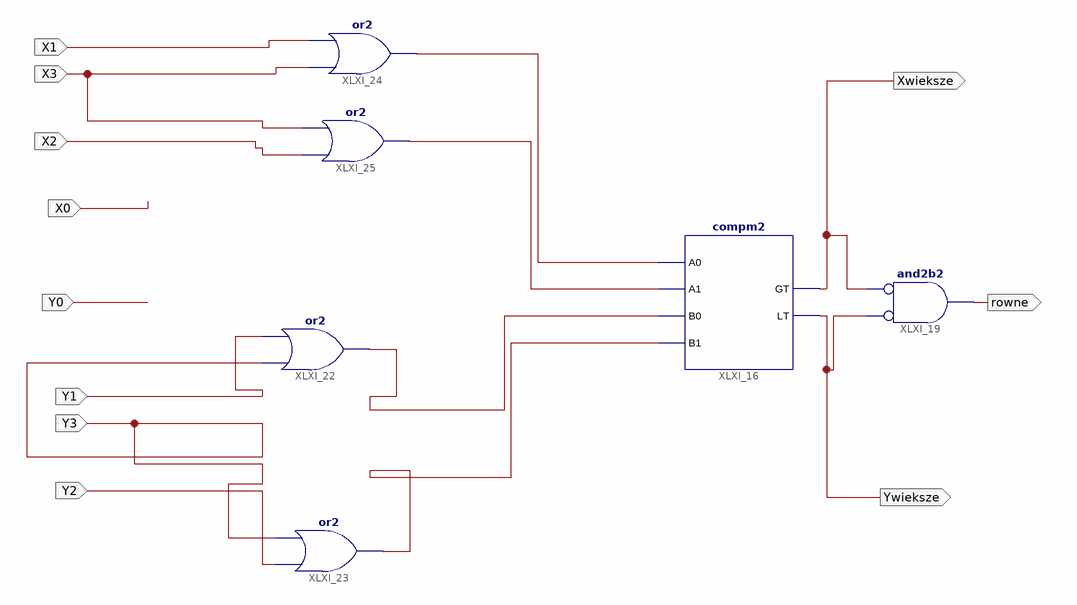
[diagram p0: schematic sheet 1]
// Xilinx ISE schematic dwaZ4_schemat.sch (artix7) as structural Verilog: 6 symbols, 11 ports
module dwaZ4_schemat (
  input  X1,
  input  X3,
  input  X2,
  input  Y1,
  input  Y3,
  input  Y2,
  input  Y0,
  input  X0,
  output Xwieksze,
  output Ywieksze,
  output rowne
);

  wire XLXN_46, XLXN_56, XLXN_57, XLXN_62;

  compm2 XLXI_16 (.A0(XLXN_56), .A1(XLXN_57), .B0(XLXN_62), .B1(XLXN_46), .GT(Xwieksze), .LT(Ywieksze));
  and XLXI_19 (rowne, ~Ywieksze, ~Xwieksze);  // and2b2
  or XLXI_22 (XLXN_62, Y3, Y1);
  or XLXI_23 (XLXN_46, Y2, Y3);
  or XLXI_24 (XLXN_56, X3, X1);
  or XLXI_25 (XLXN_57, X2, X3);
endmodule
